# EAGLE design GDEnvSensorGW_1_16 (EAGLE 9.4.0)
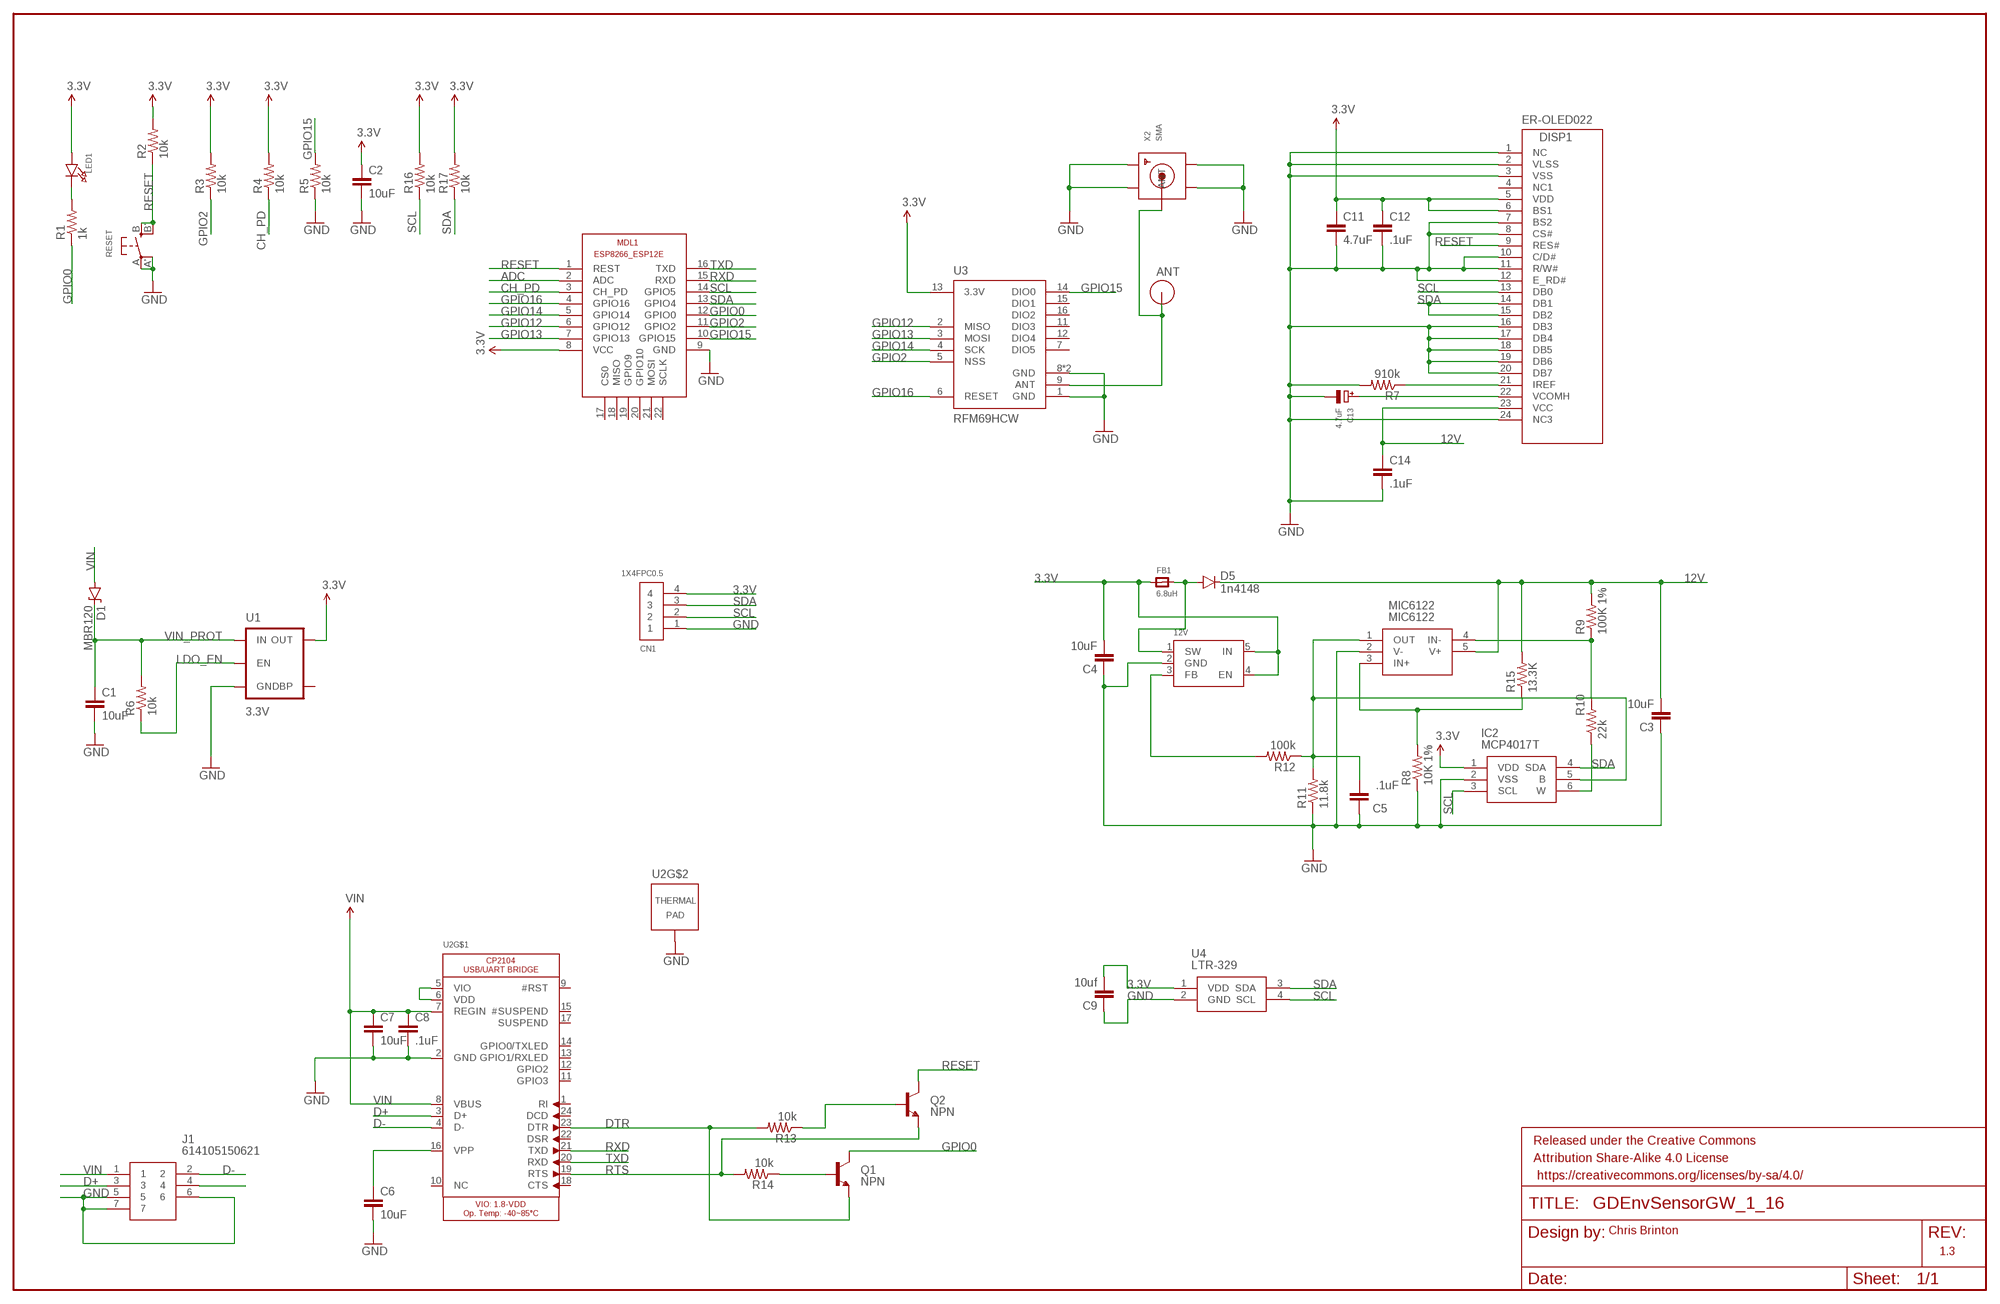
[diagram p0: schematic, sheet 1]

## Parts
12V  MP1541_SOT23-5  [SOT23-5]
ANT  RFM12B_ANTENNA  [RFM12B-ANTENNA]
C1  10uF  10UF10V10%(0805)  [0805-CAP]
C2  10uF  10UF10V10%(0805)  [0805-CAP]
C3  10uF  10UF10V10%(0805)  [0805-CAP]
C4  10uF  10UF10V10%(0805)  [0805-CAP]
C5  .1uF  10UF10V10%(0805)  [0805-CAP]
C6  10uF  10UF10V10%(0805)  [0805-CAP]
C7  10uF  10UF10V10%(0805)  [0805-CAP]
C8  .1uF  10UF10V10%(0805)  [0805-CAP]
C9  10uf  10UF10V10%(0805)  [0805-CAP]
C11  4.7uF  10UF10V10%(0805)  [0805-CAP]
C12  .1uF  10UF10V10%(0805)  [0805-CAP]
C13  4.7uF  CAP_TANTALUMA/3216_REFLOW  [EIA3216-18/A-R]
C14  .1uF  10UF10V10%(0805)  [0805-CAP]
CN1  1X4FPC0.5  [FPC_0.5MM-4]
D1  MBR120  DIODE-ZENER16V  [SOD-123]
D5  1n4148  DIODEBAS16  [SOD-323]
DISP1  ER-OLED022  [ER-OLED022]
FB1  6.8uH  FERRITE_0805  [_0805]
FRAME1  FRAME-LEDGER  [CREATIVE_COMMONS]
IC2  MCP4017T  MCP4017T-503E_LT  [SOT65P210X110-6N]
J1  614105150621  [614105150621]
LED1  LED0805  [CHIPLED_0805]
MDL1  ESP8266-ESP12F  ESP8266-12EESP8266-ESP12E  [ESP8266-ESP12E]
MIC6122  MIC6122  MIC6211YM5-TR  [SOT95P280X145-5N]
Q1  NPN  TRANSISTOR_NPNMMBT2222A  [SOT23-3]
Q2  NPN  TRANSISTOR_NPNMMBT2222A  [SOT23-3]
R1  1k  R-US_R0805  [R0805]
R2  10k  R-US_R0805  [R0805]
R3  10k  R-US_R0805  [R0805]
R4  10k  R-US_R0805  [R0805]
R5  10k  R-US_R0805  [R0805]
R6  10k  R-US_R0805  [R0805]
R7  910k  R-US_R0805  [R0805]
R8  10K 1%  R-US_R0805  [R0805]
R9  100K 1%  R-US_R0805  [R0805]
R10  22k  R-US_R0805  [R0805]
R11  11.8k  R-US_R0805  [R0805]
R12  100k  R-US_R0805  [R0805]
R13  10k  R-US_R0805  [R0805]
R14  10k  R-US_R0805  [R0805]
R15  13.3K  R-US_R0805  [R0805]
R16  10k  R-US_R0805  [R0805]
R17  10k  R-US_R0805  [R0805]
RESET  SWITCH_TACT_SMT4.6X2.8  [BTN_KMR2_4.6X2.8]
U1  3.3V  V_REG_MIC52193.3V  [SOT23-5]
U2  CP2104  [QFN24_4MM_SMSC]
U3  RFM69HCW  [RFM69HCW-XXXS2]
U4  LTR-329  LTR-329ALS-01  [LTR329ALS01]
X2  SMA  SMACONNECTOR_EDGE_UFL  [SMA_EDGELAUNCH_UFL]

## Nets
3.3V: 12V.4(EN) 12V.5(IN) C2.1 C4.2 C9.2 C11.1 C12.1 CN1.4 DISP1.5(VDD) DISP1.6(BS1) FB1.1 IC2.1(VDD) LED1.A MDL1.8(VCC) R2.2 R3.2 R4.2 R16.2 R17.2 U1.5(OUT) U3.13(3.3V) U4.1(VDD)
12V: C3.2 C14.1 D5.C DISP1.23(VCC) MIC6122.5(V+) R9.2 R15.2
ADC: MDL1.2(ADC)
ANT: ANT.P$1 U3.9(ANT) X2.P(ANT)
CH_PD: MDL1.3(CH_PD) R4.1
D+: J1.3 U2.3(D+)
D-: J1.2 U2.4(D-)
DTR: Q1.2(E) R13.2 U2.23(DTR)
GND: 12V.2(GND) C1.2 C2.2 C3.1 C4.1 C5.1 C6.2 C7.2 C8.2 C9.1 C11.2 C12.2 C13.- C14.2 CN1.1 DISP1.1(NC) DISP1.2(VLSS) DISP1.3(VSS) DISP1.7(BS2) DISP1.8(CS#) DISP1.10(C/D#) DISP1.11(R/W#) DISP1.12(E_RD#) DISP1.16(DB3) DISP1.17(DB4) DISP1.18(DB5) DISP1.19(DB6) DISP1.20(DB7) DISP1.24(NC3) IC2.2(VSS) J1.5 J1.6 J1.7 MDL1.9(GND) MIC6122.2(V-) R5.1 R7.2 R8.1 R11.1 RESET.A'(P1) RESET.A(P) U1.2(GND) U2.2(GND) U2.THERM(TP) U3.1(GND) U3.8(GND) U3.10(GND) U4.2(GND) X2.GND@1(GND1) X2.GND@2(GND2) X2.GND@3(GND3) X2.GND@4(GND4)
GPIO0: MDL1.12(GPIO0) Q1.3(C) R1.1
GPIO2: MDL1.11(GPIO2) R3.1 U3.5(NSS)
GPIO12: MDL1.6(GPIO12) U3.2(MISO)
GPIO13: MDL1.7(GPIO13) U3.3(MOSI)
GPIO14: MDL1.5(GPIO14) U3.4(SCK)
GPIO15: MDL1.10(GPIO15) R5.2 U3.14(DIO0)
GPIO16: MDL1.4(GPIO16) U3.6(RESET)
LDO_EN: R6.1 U1.3(EN)
N$1: U2.5(VIO) U2.6(VDD)
N$2: MIC6122.3(IN+) R8.2 R15.1
N$3: LED1.C R1.2
N$4: C13.+ DISP1.22(VCOMH)
N$5: C6.1 U2.16(VPP)
N$6: C5.2 IC2.5(B) MIC6122.1(OUT) R11.2 R12.1
N$7: MIC6122.4(IN-) R9.1 R10.2
N$8: 12V.1(SW) D5.A FB1.2
N$9: Q2.1(B) R13.1
N$11: DISP1.21(IREF) R7.1
N$12: IC2.6(W) R10.1
N$15: 12V.3(FB) R12.2
N$16: J1.4
N$17: Q1.1(B) R14.1
RESET: DISP1.9(RES#) MDL1.1(REST) Q2.3(C) R2.1 RESET.B'(S1) RESET.B(S)
RTS: Q2.2(E) R14.2 U2.19(RTS)
RXD: MDL1.15(RXD) U2.21(TXD)
SCL: CN1.2 DISP1.13(DB0) IC2.3(SCL) MDL1.14(GPIO5) R16.1 U4.4(SCL)
SDA: CN1.3 DISP1.14(DB1) DISP1.15(DB2) IC2.4(SDA) MDL1.13(GPIO4) R17.1 U4.3(SDA)
TXD: MDL1.16(TXD) U2.20(RXD)
VIN: C7.1 C8.1 D1.A J1.1 U2.7(REGIN) U2.8(VBUS)
VIN_PROT: C1.1 D1.C R6.2 U1.1(IN)
Unconnected: DISP1.4(NC1) MDL1.17(CS0) MDL1.18(MISO) MDL1.19(GPIO9) MDL1.20(GPIO10) MDL1.21(MOSI) MDL1.22(SCLK) U1.4(BP) U2.1(RI) U2.9(#RST) U2.10(NC) U2.11(GPIO3) U2.12(GPIO2) U2.13(GPIO1/RXLED) U2.14(GPIO0/TXLED) U2.15(#SUSPEND) U2.17(SUSPEND) U2.18(CTS) U2.22(DSR) U2.24(DCD) U3.7(DIO5) U3.11(DIO3) U3.12(DIO4) U3.15(DIO1) U3.16(DIO2)

## Notes on the sheet
- Chris Brinton
- 1.3

## Library data of the parts
12V = GDTech:MP1541_SOT23-5: SOT23-5 MP1541 Voltage Boost The MP1541 is a 5-pin thin SOT23 current mode step up converter intended for small, low power applications
ANT = LowPowerLab:RFM12B_ANTENNA; LABEL: ANT
C1-C9 C11 C12 C14 = SparkFun-Capacitors:10UF10V10%(0805): CAP-11330; PROD_ID: CAP-11330
C13 = microbuilder:CAP_TANTALUM: Tantalum Capacitors Wave footprints have larger pads and are meant to be used for hand soldering. Reflow footprints are optimised for solder paste and a reflow oven. EIA3216-18/A-[R/W] - Size A / 3216-18 / 1206 footprint 4.7µF 25V 10% Tantalum Capacitor 10µF 16V 10% Tantalum Capacitor [Digikey: 495-2236-2-ND] EIA3528-21/B-[R/W] - Size B / 3528-21 47µF 10V 10% Tantalum Capactior [Digikey: 495-2216-1-ND] EIA6032-28/C-[R/W] - Size C / 6032-28 10µF 35V 20% Tantalum Capacitor [Digikey: 495-2285-1-ND] 100µF 16V 10% Tantalum Capactior [Digikey: 399-5214-1-ND]
CN1 = adafruit:1X4: 4-pin connector
D1 = SparkFun-DiscreteSemi:DIODE-ZENER: Zener Diode Production Part - 8199 3.4V Zener Voltage; PROD_ID: DIO-12440; VALUE: 16V
D5 = SparkFun-DiscreteSemi:DIODE: Diode These are standard reverse protection diodes and small signal diodes. SMA package can handle up to about 1A. SOD-323 can handle about 200mA. What the SOD-323 package when ordering, there are some mfgs out there that are 5-pin packages.; PROD_ID: DIO-09646; VALUE: 250mA/100V
DISP1 = GDTech:ER-OLED022: East Rising 2.2" OLED display 128x32 24 pin .5mm pitch FPC connector
FB1 = microbuilder:FERRITE: Ferrite Bead 0603 MMZ1608B121C - 120 Ohm @ 100MHz, 600mA, 0.15 Ohm DC Resistance - Digikey: 445-2164-1-ND BK1608HW121-T - 120 Ohm, 600mA Ferrite Chip - Digikey: 587-1876-2-ND 0805 HZ0805B272R-10 - 2.7K Ohm @ 100MHz, 200mA, 0.8 Ohm DC Resistance - Digikey: 240-2504-1-ND (see also Murata BLM21BD272SN1L) MMZ2012Y152B - 1.5K Ohm @ 100MHz, 500mA, 0.4 Ohm DC Resistance - Digikey: 445-1560-1-ND - Mainly for high frequency (80-400MHz) MMZ2012R102A - 1K Ohm @ 100MHz, 500mA, 0.3 Ohm DC Resistance - Digikey: 445-1555-2-ND - More general purpose (10-200MHz)
FRAME1 = SparkFun-Aesthetics:FRAME-LEDGER: Schematic Frame Standard 11x14 US Ledger frame
IC2 = SamacSys_Parts:MCP4017T-503E_LT: Digital POT Source: Datasheet <http://componentsearchengine.com/Datasheets/3/MCP4017T-503E_LT.pdf>; ALLIED_NUMBER: 70388684; ALLIED_PRICE-STOCK: https://www.alliedelec.com/microchip-technology-inc-mcp4017t-503e-lt/70388684/; DESCRIPTION: Digital POT; HEIGHT: mm; MANUFACTURER_NAME: Microchip; MANUFACTURER_PART_NUMBER: MCP4017T-503E/LT; MOUSER_PART_NUMBER: 579-MCP4017T503E/LT; MOUSER_PRICE-STOCK: https://www.mouser.com/Search/Refine.aspx?Keyword=579-MCP4017T503E%2FLT; RS_PART_NUMBER: 7386796P; RS_PRICE-STOCK: http://uk.rs-online.com/web/p/products/7386796P
J1 = SamacSys_Parts:614105150621: WURTH ELEKTRONIK - 614105150621 - MICRO USB, 2.0 TYPE AB, PLUG, CABLE Source: Datasheet <http://katalog.we-online.de/em/datasheet/614105150621.pdf>; DESCRIPTION: WURTH ELEKTRONIK - 614105150621 - MICRO USB, 2.0 TYPE AB, PLUG, CABLE; HEIGHT: 5mm; MANUFACTURER_NAME: Wurth Elektronik; MANUFACTURER_PART_NUMBER: 614105150621; MOUSER_PART_NUMBER: 710-614105150621; MOUSER_PRICE-STOCK: https://www.mouser.com/Search/Refine.aspx?Keyword=710-614105150621; RS_PART_NUMBER: 1225098; RS_PRICE-STOCK: http://uk.rs-online.com/web/p/products/1225098
LED1 = microbuilder:LED: LED 0603 - 0603 Surface Mount Package 2mA: Green LED - Low Power (3.9mcd, 2ma, 1.7Vf) - Digikey: 475-2709-2-ND Orange LED - Low Power (9.8mcd, 2ma, 1.8Vf) - Digikey: 475-1194-2-ND Red LED - Low Power (5mcd, 2ma, 1.8Vf) - Digikey: 475-1195-2-ND Yellow LED - Low Power (7mcd, 2ma, 1.8Vf) - Digikey: 475-1196-2-ND 5mA: Blue LED - Low Power (17mcd, 5ma, 2.9Vf) - Digikey: LNJ937W8CRACT-ND 0805 - 0805 Surface Mount Package 2mA: Red LED (8.8mcd, 2mA, 1.8Vf, Clear) - Low Power [Digikey: 475-2510-1-ND] Green LED (5mcd, 2mA, 1.8Vf, Clear) - Low Power [Digikey: 475-2730-1-ND] Yellow LED (11.3mcd, 2mA, 1.8Vf, Clear) - Low Power [Digikey: 475-2555-1-ND] 20mA: Red LED (104mcd, 20mA, Diffused) - LS R976 [Digikey: 475-1278-6-ND] Red LED (12mcd, 20mA, 2.0Vf, Clear) - APT2012EC [Digikey: 754-1128-1-ND] Green LED (15mcd, 20mA, 2.2Vf, Clear) - APT2012GC [Digikey: 754-1131-1-ND] Orange LED (160mcd, 20mA, 2.1Vf, Clear) - APT2012SECK [Digikey: 754-1130-1-ND] 1206 - 1206 Surface Mount Package Green LED (26mcd, 20mA, Diffused) - LG N971 [Digikey: 475-1407-6-ND] Red LED (15mcd, 20mA, Diffused) - LH N974 [Digikey: 475-1416-6-ND]
MDL1 = ESP12E:ESP8266-12E: ESP8266-12E with additional I/O and GPIO04/05 corrected The author cannot warrant that this library is free from error or will meet your specific requirements. Created by PuceBaboon.com. Komagane, Nagano, JAPAN
MIC6122 = SamacSys_Parts:MIC6211YM5-TR: Operational Amplifiers - Op Amps Source: Datasheet <http://ww1.microchip.com/downloads/en/DeviceDoc/mic6211.pdf>; DESCRIPTION: Operational Amplifiers - Op Amps; HEIGHT: 1.45mm; MANUFACTURER_NAME: Micrel; MANUFACTURER_PART_NUMBER: MIC6211YM5-TR; MOUSER_PART_NUMBER: 998-MIC6211YM5TR; MOUSER_PRICE-STOCK: https://www.mouser.com/Search/Refine.aspx?Keyword=998-MIC6211YM5TR
Q1 Q2 = SparkFun-DiscreteSemi:TRANSISTOR_NPN: Generic NPN BJT MMBT2222A - TRANS-08049 (SOT-23, 1A 40V) MPSA42 - TRANS-09116 (SOT-23, 500mA 300V) MMBT5088LT1G - TRANS-11160 (SOT-23, 50 mA 30V) BC547 - COM-08928 <http://www.sparkfun.com/products/8928> (TO-92 45V 100mA) (1.Collector 2.Base 3.Emitter) 2N3904 - COM-00521 <http://www.sparkfun.com/products/521> (TO-92 40V 200mA) (1.Emitter 2.Base 3.Collector) P2N2222A - COM-12852 <http://www.sparkfun.com/products/12852> (TO-92 40V 600mA) (1.Collector 2.Base 3.Emitter); PROD_ID: TRANS-08049; VALUE: MMBT2222A
R1-R17 = adafruit:R-US_: RESISTOR, American symbol
RESET = microbuilder:SWITCH_TACT_SMT: SMT Tact Switches 6x6mm - Digikey: P12940SCT-ND KMR2 (4.6x2.8mm) - Digikey: 401-1426-1-ND EVQ-PQHB55 - Light Touch, 160GF (4.5x4.5mm) - Digikey: P8090SCT-ND
U1 = SparkFun-PowerIC:V_REG_MIC5219: V_REG MIC5219 Standard 3.3V and 5V 500mA LDO voltage regulator in SOT-23 layout. Micrel part MIC5219. BP (by-pass) pin is used to lower output noise with 470pF cap, may be left open.; PROD_ID: VREG-09872; VALUE: MIC5219 3.3V
U2 = GDTech:CP2104: CP2104 - USB to UART Bridge VDD Output: 3.45V
U3 = SparkFun-RF:RFM69H; PROD_ID: IC-11997, IC-12053
U4 = SamacSys_Parts:LTR-329ALS-01: Ambient Light Sensors Ambient Light Photo Sensor Source: Datasheet <http://www.mouser.com/ds/2/239/liteon_LTR-329ALS-01-1175539.pdf>; DESCRIPTION: Ambient Light Sensors Ambient Light Photo Sensor; HEIGHT: 0mm; MANUFACTURER_NAME: Lite-On; MANUFACTURER_PART_NUMBER: LTR-329ALS-01; MOUSER_PART_NUMBER: 859-LTR-329ALS-01; MOUSER_PRICE-STOCK: https://www.mouser.com/Search/Refine.aspx?Keyword=859-LTR-329ALS-01
X2 = adafruit:SMACONNECTOR: SMA Connector 90° DIP SMA Connector, 50 Ohm (4UConnector: 07259)

## Board
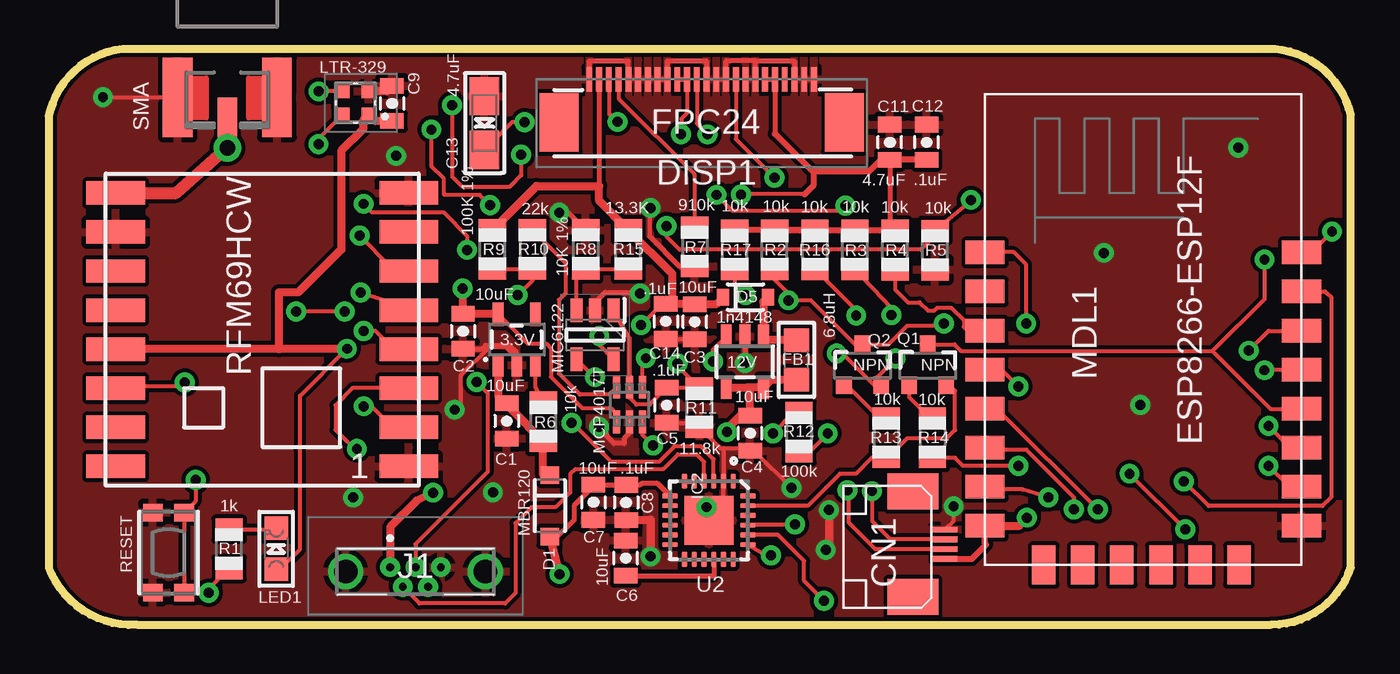
[diagram p1: board, top side]
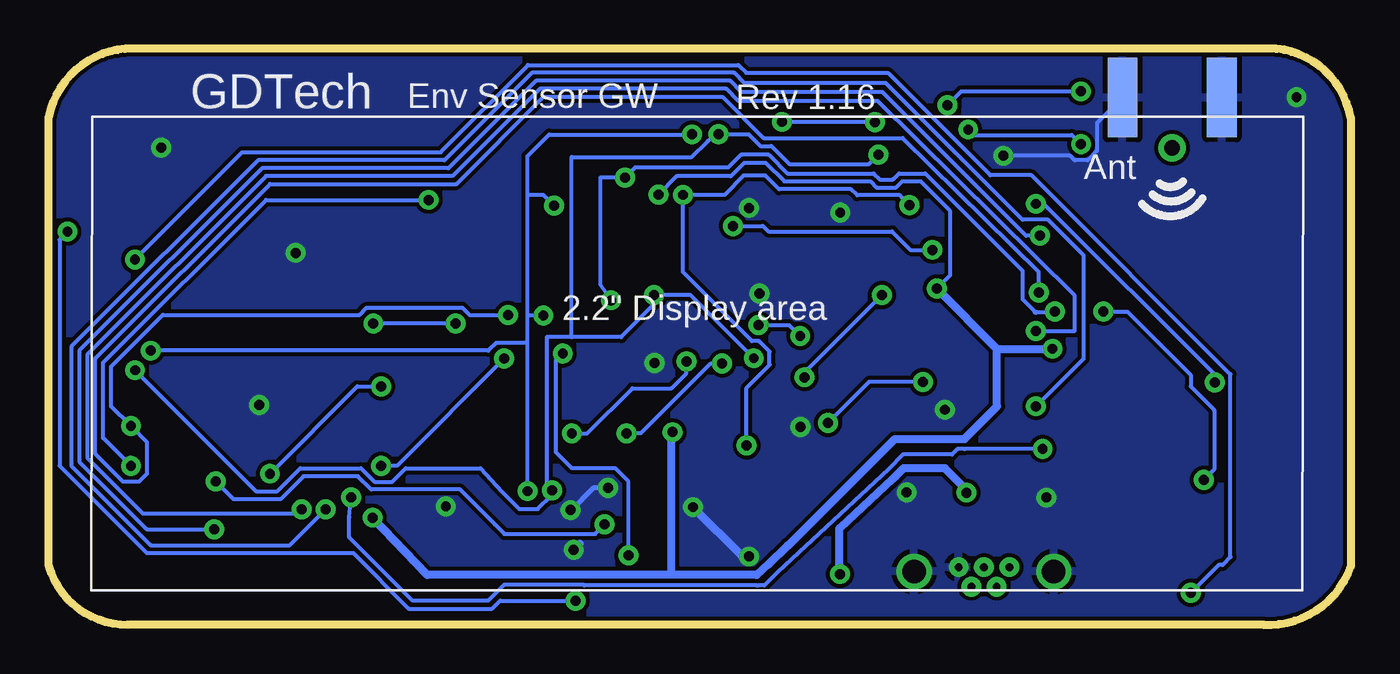
[diagram p2: board, bottom side, seen from below]

Size 66.64 x 29.5 mm. Coordinates in mm from the lower left corner, seen from the top.
Outline: 0,25.99 arc-74 3.8,29.5 62.74,29.5 arc-74 66.64,26.04 66.64,3 arc-74 62.59,0.01 4.49,0.01 arc-74 0,2.97 0,25.99
Copper layers (1*16): Top 0.035mm / dielectric 1.5mm / Bottom 0.035mm
Design rules "SparkFun": minimum track width 8mil, minimum drill 20mil, track to track 8mil, track to pad 8mil, pad to pad 8mil, via to via 8mil, smd to smd 8mil, copper to edge 8mil, drill to drill 8mil, minimum pad ring 12mil, minimum via ring 10mil, stop-mask expansion 4mil, vias tented up to drill 20mil, thermal gap 10mil

### Footprints (pad centres in the part's own frame; a part is rotated, then mirrored left to right if it is on the bottom)
SOT23-5 = smd 0.55 x 1.2: 1 -0.95,-1.3; 2 0,-1.3; 3 0.95,-1.3; 4 0.95,1.3; 5 -0.95,1.3
RFM12B-ANTENNA = drill 0.8 pad 1.422: P$1 0,0
0805-CAP = smd 0.8 x 1.2: 1 -0.9,0; 2 0.9,0
EIA3216-18/A-R = smd 1.95 x 1.5: + 1.375,0; - -1.375,0
FPC_0.5MM-4 = smd 0.3 x 1.25: 1 -0.75,-0.45; 2 -0.25,-0.45; 3 0.25,-0.45; 4 0.75,-0.45 | smd 1.85 x 2.6: MT -2.7,-2.1; MT2 2.7,-2.1
SOD-123 = smd 0.9 x 0.95: A 1.575,0; C -1.575,0
SOD-323 = smd 0.63 x 0.83: A 1.15,0; C -1.15,0
ER-OLED022 = smd 0.3 x 1.25: 1 5.75,12.905; 2 5.25,12.905; 3 4.75,12.905; 4 4.25,12.905; 5 3.75,12.905; 6 3.25,12.905; 7 2.75,12.905; 8 2.25,12.905; 9 1.75,12.905; 10 1.25,12.905; 11 0.75,12.905; 12 0.25,12.905; 13 -0.25,12.905; 14 -0.75,12.905; 15 -1.25,12.905; 16 -1.75,12.905; 17 -2.25,12.905; 18 -2.75,12.905; 19 -3.25,12.905; 20 -3.75,12.905; 21 -4.25,12.905; 22 -4.75,12.905; 23 -5.25,12.905; 24 -5.75,12.905 | smd 2 x 3: MOUNT1 -7.3,10.705; MOUNT2 7.3,10.705
_0805 = smd 1.2 x 1.3: 1 -1.016,0; 2 1.016,0
SOT65P210X110-6N = smd 1.168 x 0.356: 1 -0.889,0.66; 2 -0.889,0; 3 -0.889,-0.66; 4 0.889,-0.66; 5 0.889,0; 6 0.889,0.66
614105150621 = drill 0.4 pad 0.9: 1 -1.3,-0.065; 2 -0.65,-1.065; 3 0,-0.065; 4 0.65,-1.065; 5 1.3,-0.065 | drill 1.2 pad 1.8: 6 -3.575,-0.285; 7 3.575,-0.285
CHIPLED_0805 = smd 1.2 x 1.2: A 0,-1.05; C 0,1.05
ESP8266-ESP12E = smd 2 x 1.2: 1 0,16; 2 0,14; 3 0,12; 4 0,10; 5 0,8; 6 0,6; 7 0,4; 8 0,2; 9 16.2,2; 10 16.2,4; 11 16.2,6; 12 16.2,8; 13 16.2,10; 14 16.2,12; 15 16.2,14; 16 16.2,16 | smd 1.2 x 2: 17 11,0; 18 3,0; 19 5,0; 20 13,0; 21 7,0; 22 9,0
SOT95P280X145-5N = smd 1.2 x 0.6: 1 -1.25,0.95; 2 -1.25,0; 3 -1.25,-0.95; 4 1.25,-0.95; 5 1.25,0.95
SOT23-3 = smd 0.8 x 0.9: 1 -0.95,-1; 2 0.95,-1; 3 0,1.1
R0805 = smd 1.1 x 1.4: 1 -1,0; 2 1,0
BTN_KMR2_4.6X2.8 = smd 0.9 x 1: A 2.05,0.8; A' -2.05,0.8; B 2.05,-0.8; B' -2.05,-0.8
QFN24_4MM_SMSC = smd 0.8 x 0.28: 1 -2,1.25; 2 -2,0.75; 3 -2,0.25; 4 -2,-0.25; 5 -2,-0.75; 6 -2,-1.25; 13 2,-1.25; 14 2,-0.75; 15 2,-0.25; 16 2,0.25; 17 2,0.75; 18 2,1.25 | smd 0.28 x 0.8: 7 -1.25,-2; 8 -0.75,-2; 9 -0.25,-2; 10 0.25,-2; 11 0.75,-2; 12 1.25,-2; 19 1.25,2; 20 0.75,2; 21 0.25,2; 22 -0.25,2; 23 -0.75,2; 24 -1.25,2 | smd 2.5 x 2.5: THERM 0,0
RFM69HCW-XXXS2 = smd 3 x 1.2: 1 -7.5,7; 2 -7.5,5; 3 -7.5,3; 4 -7.5,1; 5 -7.5,-1; 6 -7.5,-3; 7 -7.5,-5; 8 -7.5,-7; 9 7.5,-7; 10 7.5,-5; 11 7.5,-3; 12 7.5,-1; 13 7.5,1; 14 7.5,3; 15 7.5,5; 16 7.5,7
LTR329ALS01 = smd 0.7 x 0.75: 1 -0.6,-0.4; 2 0.6,-0.4; 3 0.6,0.95; 4 -0.6,0.95
SMA_EDGELAUNCH_UFL = smd 4.064 x 1.524: GND@1 2.032,-2.54; GND@2 2.032,2.54 | smd 4.064 x 1.524 bottom: GND@3 2.032,2.54; GND@4 2.032,-2.54 | smd 2.032 x 1.016: P 3.048,0

### Placement (x,y rotation side)
12V  35.63,13.47 180 top
ANT  9.14,24.43 0 top
C1  23.44,10.44 270 top
C2  21.2,15.03 270 top
C3  33.07,15.52 90 top
C4  35.9,9.82 90 top
C5  31.63,11.25 90 top
C6  29.53,3.42 90 top
C7  27.88,6.28 270 top
C8  29.55,6.27 270 top
C9  17.57,26.7 270 top
C11  43.05,24.71 90 top
C12  44.93,24.72 90 top
C13  22.3,25.7 270 top
C14  31.58,15.54 270 top
CN1  46.33,4.13 270 top
D1  25.64,6.1 270 top
D5  35.66,16.78 0 top
DISP1  33.42,15.03 0 top
FB1  38.27,13.57 90 top
FRAME1  1.73,-12.1 0 top  (outside the outline)
IC2  29.72,11.28 90 top
J1  18.77,3.02 0 top
LED1  11.64,3.9 0 top
MDL1  47.92,3.07 0 top
MIC6122  27.96,14.85 270 top
Q1  44.99,13.27 0 top
Q2  41.65,13.27 0 top
R1  9.23,3.89 90 top
R2  37.15,19.21 90 top
R3  41.26,19.2 90 top
R4  43.32,19.19 90 top
R5  45.36,19.18 90 top
R6  25.31,10.39 270 top
R7  33.06,19.35 270 top
R8  27.48,19.23 270 top
R9  22.71,19.23 90 top
R10  24.75,19.23 270 top
R11  33.3,11.12 90 top
R12  38.4,9.87 270 top
R13  42.86,9.58 270 top
R14  45.23,9.58 270 top
R15  29.66,19.23 90 top
R16  39.22,19.21 90 top
R17  35.11,19.21 90 top
RESET  6.13,3.7 90 top
U1  23.95,14.61 0 top
U2  33.79,5.36 270 top
U3  10.92,15.12 180 top
U4  15.98,26.73 90 top
X2  9.14,29.04 270 top

### Tracks (layer width: path | path; a pad name or v marks a point on that pad's centre or on a via)
3.3V  (via drill 0.51, 0.51 pad 1.02)
  Top 0.203: R3.2 41.28,20.22 43.32,20.22 | LED1.A 11.84,2.86 12.86,3.88 12.86,11.73 15.24,14.12 | 38.69,22.05 35.46,22.05 v35.44,22.03 | U1.5 24.51,14.4 25.47,14.4 25.7,14.16 25.7,12.7 27.3,11.1 28.77,11.1 29.06,10.81 IC2.1 | R4.2 43.31,20.18 43.21,20.18 | 35.77,12.17 35.9,12.17
  Top 0.254: 37.17,25.15 DISP1.5 DISP1.6 | C11.1 43.05,20.46 R4.2
  Top 0.305: 39.13,23.19 39.13,22.48 38.69,22.05 | 37.17,25.15 39.13,23.19 | R2.2 37.18,20.18 43.21,20.18 | R4.2 43.32,20.22 | C12.1 44.98,23.81 C11.1 42.58,23.81 41.97,23.2 39.14,23.2 39.13,23.19 | CN1.4 47.24,3.38 47.97,4.11 47.92,4.15 MDL1.8 | R16.2 R2.2 | R2.2 R17.2
  Top 0.406: U1.5 21.23,15.91 C2.1 21.18,15.95 v21.18,17.22 | 11.77,14.12 15.24,14.12 v15.26,14.14 | 11.77,14.12 U3.13 | MDL1.8 49.68,5.07 v50.07,5.49 | 12V.4 35.77,12.17 | FB1.1 36.96,12.55 12V.5 35.9,12.17 C4.2 35.4,10.72 34.72,10.04 v34.72,9.87 | 11.77,14.12 11.77,17.02 12.77,17.02 14.96,19.21 14.96,24.27 16.09,25.4 16.09,25.84 U4.1 16.71,25.8 C9.2
  Bottom 0.203: v21.18,17.22 20.49,17.91 20.49,21.19 22.01,22.71 22.95,22.71 23.27,22.4 24.27,22.4 24.59,22.71 28.99,22.71 29.95,23.66 31.03,23.66 31.72,22.97 34.5,22.97 v35.44,22.03
  Bottom 0.406: 18.1,14.14 v15.26,14.14 | 18.1,14.14 v21.18,17.22 | v50.07,5.49 47.27,2.56 35.77,2.56 34.77,2.56 | 34.77,2.56 30.48,2.57 30.41,2.55 29.77,3.12 28.84,4.05 28.8,4.05 23.34,9.52 19.77,9.52 18.1,11.19 18.1,14.14 | 34.77,2.56 34.77,9.82 v34.72,9.87
12V  (via drill 0.51)
  Top 0.203: MIC6122.5 28.18,14.33 v28.18,14.79 | v30.31,15.35 31.4,16.44 C14.1
  Top 0.254: DISP1.23 28.17,22.47
  Top 0.406: D5.C 34.14,16.41 C3.2 31.6,16.42 C14.1 31.9,16.75 31.9,17.99 R15.2 28.17,21.72 28.17,22.47 24.96,22.47 R9.2
  Bottom 0.203: v28.18,14.79 28.73,15.34 v30.31,15.34 v30.31,15.35
ANT
  Top 0.61: U3.9 6.52,22.12 ANT.P$1 9.16,24.92 X2.P
CH_PD
  Top 0.203: R4.1 43.32,17.18 43.98,16.52 44.57,16.52 45,16.09 45.33,16.09 45.48,16.24 46.19,16.24 46.83,15.6 46.83,15.26 47,15.09 47.91,15.09 MDL1.3
D+  (via drill 0.51)
  Top 0.203: U2.3 34.03,8.48 33.37,9.14 32.03,9.14 31.26,8.38 28.77,8.38 26.81,10.34 v26.75,10.34 | v21.9,12.44 22.46,11.88 22.46,7.83 18.77,4.14 J1.3
  Bottom 0.203: v21.9,12.44 24.65,12.44 v26.75,10.34
D-
  Top 0.203: U2.4 33.54,8.34 33.14,8.73 32.19,8.73 31.43,7.97 26.94,7.97 26.69,7.72 26.69,6.78 25.93,6.02 24.7,6.02 23.89,5.21 23.89,1.63 23.36,1.1 18.97,1.1 J1.2
DTR
  Top 0.203: Q1.2 46.1,12.27 46.38,11.98 46.38,9.97 45.98,9.57 43.94,9.57 42.93,8.55 R13.2 42.72,8.55 42.12,8.55 41.3,7.74 40.49,7.74 39.77,7.02 38.85,6.1 U2.23
GND  (via drill 0.51, 0.51 pad 1.02)
  Top 0.203: DISP1.11 DISP1.10 | DISP1.2 DISP1.1 | X2.GND@1 2.78,27.01 v2.77,27.02 | CN1.1 46.32,5.32 v46.32,6.07 | C5.1 33.07,10.35 R11.1 34.39,9.02 34.54,9.02 | 34.54,9.02 U2.2 | 34.54,9.02 35.79,9.02 C4.1 36.1,8.92 v38.01,7.01 | C14.2 33.05,14.64 | 33.05,14.64 33.18,14.64 | 33.05,14.64 C3.1 33.22,14.62 | U2.THERM 34.54,6.11 34.54,7.02 | 30.77,19.87 30.77,21.33 v30.79,21.35 | C9.1 17.3,27.33 | v20.77,11.02 21.09,11.33 21.09,12.77 22.52,14.21 23.4,14.21 23.65,13.97 23.94,13.97
  Top 0.254: DISP1.16 31.68,27.93 31.69,27.93 DISP1.16 | U2.2 34.54,7.02 | 33.79,5.88 U2.THERM | C2.2 22.16,14.13 22.35,14.32 23.59,14.32 23.94,13.97 U1.2 | DISP1.24 27.67,28.84 27.66,28.85 27.66,28.88 27.67,28.89 29.66,28.89 DISP1.20 | DISP1.12 33.66,28.89 31.9,28.89 31.92,28.89 31.67,28.89 31.67,28.88 DISP1.16 | DISP1.10 34.67,28.86 34.67,28.9 34.86,28.89 34.88,28.89 36.16,28.89 | DISP1.7 36.17,28.88 36.16,28.89 | 36.16,28.89 38.15,28.89 38.16,28.88 DISP1.3 | DISP1.17 DISP1.16 | IC2.2 29.72,9.81 29.45,9.54 29.45,9.29 28.93,9.29 28.55,9.67 28.55,9.75 v28.17,10.13 | MIC6122.2 27.96,16.51 28.47,17.03 30.21,17.03 v30.27,16.97 | 12V.2 v35.63,13.41 | R7.2 32.29,18.35 30.77,19.87 | R8.1 26.6,21.1 v26.13,21.1
  Top 0.406: C8.2 30.78,5.37 30.8,5.39 v30.8,3.5 | v39.77,3.84 39.94,4.01 v39.94,5.88 | 17.3,27.33 U4.2
  Bottom 0.203: X2.GND@2 12.99,25.7 12.99,24.27 13.46,23.79 14.14,23.79 14.36,24.02 v17.77,24.02
  Bottom 0.254: v38.01,7.01 38.78,7.01 39.94,5.85 v39.94,5.88
  Bottom 0.406: v30.8,3.5 31.14,3.5 v33.67,6.03 | v39.77,3.84 39.47,4.15
  other vias: 54,19.05 60.89,24.44 55.88,11.27 22.73,6.79 15.58,6.52
  pour Top: 4.05,30.43 62.6,29.59 arc-90 66.67,25.52 67.67,3.43 arc-90 63.18,-0.08 3.86,-0.02 arc-90 -0.05,3.04 -0.08,26.19 arc-90
  pour Bottom: 4.27,29.32 63.04,30.03 arc-90 67.77,24.82 66.77,3.52 arc-90 63.27,0.02 4.17,-1.38 arc-90 0.06,2.64 0.07,25.22 arc-90
GPIO0  (via drill 0.51)
  Top 0.203: Q1.3 46.36,14.37 46.7,14.03 59.56,14.03 | 59.56,14.03 62.53,11.06 64.11,11.06 MDL1.12 | v8.18,1.64 8.18,1.85 9.2,2.86 R1.1 | v62.23,18.71 62.23,16.68 59.59,14.04 59.56,14.03
  Bottom 0.203: v8.18,1.64 6.76,3.07 6.56,3.07 6.15,3.47 6.15,12.83 16.34,23.02 18.45,23.02 23.69,28.26 30.94,28.26 31.35,28.67 42.12,28.67 46.59,24.2 56.75,24.2 v62.23,18.71
GPIO2  (via drill 0.51)
  Top 0.203: v62.44,10.18 63.45,9.16 64.06,9.16 MDL1.11 | v43.13,15.87 43.13,16.22 R3.1 | v15.97,17.02 18.34,16.27 U3.5
  Bottom 0.203: v15.97,17.02 15.97,18.07 22.94,24.93 30.05,24.93 32.16,27.04 41.3,27.04 45.77,22.57 55.32,22.57 64.26,13.63 64.26,8.76 62.84,7.33 62.03,7.33 61.62,7.74 61.62,9.36 v62.44,10.18 63.45,11.19 63.45,13.23 60.81,15.87 50.74,15.87 50.37,16.24 45.48,16.24 45.11,15.87 v43.13,15.87
GPIO12  (via drill 0.51)
  Top 0.203: v52.48,5.91 52.48,6.52 50.04,8.96 48.01,8.96 MDL1.6 | v16.11,11.19 16.51,11.19 17.53,10.18 18.34,10.18 U3.2
  Bottom 0.203: v52.48,5.91 54.31,4.08 61.42,4.08 65.48,8.15 65.48,14.24 55.93,23.79 46.38,23.79 41.91,28.26 31.55,28.26 31.03,27.74 23.79,27.74 16.79,20.74 15.5,20.74 13.67,18.92 13.67,13.63 v16.11,11.19
GPIO13  (via drill 0.51, 0.51 pad 1.02)
  Top 0.203: v51.17,6.52 49.84,6.93 48.01,6.93 MDL1.7 | U3.3 15.55,12.12 14.67,11.24 14.67,9.99 15.66,9 15.75,9 v15.77,9.02
  Bottom 0.203: v51.17,6.52 51.26,5.5 51.26,4.49 48.01,1.24 44.15,1.24 43.33,2.05 39.27,2.05 39.24,2.02 30.4,2.02 30.35,2 30.32,2.02 30.01,2.02 29.35,2.68 23.66,7.97 22.91,8.72 20.41,8.72 20.12,9.01 19.77,9.01 18.11,9.02 v15.77,9.02
GPIO14  (via drill 0.51)
  Top 0.203: v53.7,5.91 48.62,10.99 48.01,10.99 MDL1.5 | v16.11,15.05 16.72,15.05 17.53,14.24 18.34,14.24 U3.4
  Bottom 0.203: v53.7,5.91 53.9,5.71 61.83,5.71 64.67,8.55 64.67,13.84 55.53,22.98 45.98,22.98 41.51,27.45 31.96,27.45 31.33,26.82 24.21,26.82 14.12,16.86 14.12,15.06 v16.11,15.05
GPIO15  (via drill 0.51)
  Top 0.203: v62.44,8.15 63.45,7.13 64.06,7.13 MDL1.10 | v47.2,21.76 46.94,21.51 R5.2 45.5,20.06 44.64,19.21 32.29,19.21 31.62,19.88 v31.62,20.43 | v6.96,12.41 6.76,12.21 3.51,12.21 U3.14 | v21.41,19.2 21.41,19.92 20.2,21.13 16.54,21.13 v16.11,21.56
  Bottom 0.203: v47.2,21.76 55.53,21.76 63.86,13.43 63.86,9.57 v62.44,8.15 | v6.96,12.41 6.96,12.82 15.7,21.56 v16.11,21.56 | v31.62,20.43 30.1,20.43 29.81,20.14 23.48,20.14 22.54,19.2 v21.41,19.2
GPIO16  (via drill 0.51)
  Top 0.203: v49.63,12.21 48.82,13.02 48.01,13.02 MDL1.4 | v58.17,4.89 v55.32,7.74 | v15.9,19.93 17.53,18.31 18.34,18.31 U3.6
  Bottom 0.203: v49.63,12.21 50.85,12.21 v55.32,7.74 | v58.17,4.89 61.62,4.89 65.08,8.35 65.08,14.04 55.73,23.39 46.18,23.39 41.71,27.86 31.75,27.86 31.18,27.29 23.97,27.29 16.62,19.93 v15.9,19.93
LDO_EN
  Top 0.203: U1.3 24.9,12.18 R6.1
N$1
  Top 0.254: U2.6 U2.5
N$2
  Top 0.203: MIC6122.3 27.01,17.76 R8.2 R15.1
N$3
  Top 0.203: R1.2 11.59,4.89 LED1.C
N$4  (via drill 0.51 pad 1.02)
  Top 0.203: DISP1.22 28.68,26.13 28.71,26.16 v29.11,25.76 | v24.36,25.75 23.72,25.75 C13.+
  Bottom 0.203: v29.11,25.76 v24.37,25.76 v24.36,25.75
N$5
  Top 0.254: C6.1 34.04,2.52 U2.16
N$6  (via drill 0.51)
  Top 0.203: IC2.5 29.72,11.63 30.08,11.28 30.76,11.28 C5.2 31.66,12.12 R11.2 32.17,13.24 v32.17,13.38 | v37.06,9.81 38.12,10.87 R12.1
  Top 0.254: IC2.5 29.72,14.67 MIC6122.1
  Bottom 0.203: v32.17,13.38 32.77,13.38 36.34,9.81 v37.06,9.81
N$7  (via drill 0.51)
  Top 0.203: R9.1 R10.2 24.75,17.64 v24,16.88 | v27.96,12.68 27.93,12.68 MIC6122.4
  Bottom 0.203: v24,16.88 27.96,12.92 v27.96,12.68
N$8
  Top 0.406: FB1.2 36.76,14.58 12V.1 36.58,16.55 D5.A
N$9
  Top 0.203: Q2.1 40.75,12.35 42.72,10.38 R13.1
N$11
  Top 0.203: DISP1.21 29.17,26.95 33.04,23.08 33.04,20.33 R7.1
N$12
  Top 0.203: R10.1 26.44,18.54 26.44,16.97 26.11,16.64 26.11,12.87 27.18,11.8 28.69,11.8 IC2.6
N$15  (via drill 0.51)
  Top 0.203: v39.87,9.8 38.94,8.87 R12.2 | v34,13.49 34,14.09 12V.3
  Bottom 0.203: v39.87,9.8 39.09,9.8 36.77,12.12 34.77,12.12 34,12.88 v34,13.49
N$17
  Top 0.203: Q1.1 44.04,11.67 45.22,10.49 R14.1
RESET  (via drill 0.51 pad 1.02)
  Top 0.203: RESET.B' RESET.B 7.51,6.33 v7.51,7.42 | v45.82,15.43 45.72,15.32 43.94,15.32 42.99,14.37 Q2.3 41.26,14.37 39.01,16.62 v37.87,16.62 37.87,16.98 37.15,17.69 R2.1 | v50.03,15.43 50.03,18.45 49.4,19.08 MDL1.1 | DISP1.9 35.17,24.88 v37.15,22.9 | v15.15,16.04 v12.66,16.04
  Bottom 0.203: v45.82,15.43 v50.03,15.43 | v37.87,16.62 38.42,17.44 38.42,22.9 v37.15,22.9 36.62,23.43 31.85,23.43 31.21,24.07 29.78,24.07 28.82,23.12 24.42,23.12 24.11,22.81 23.43,22.81 23.12,23.12 21.78,23.12 16.8,18.14 16.8,16.68 16.14,16.02 | 16.11,16.02 15.17,16.02 v15.15,16.04 | v12.66,16.04 11.42,16.04 8.19,12.81 8.19,12.21 6.98,11 6.98,7.95 v7.51,7.42
  Bottom 0.254: 16.14,16.02 16.11,16.02
RTS  (via drill 0.51)
  Top 0.203: v40.33,13.9 40.63,13.9 42.23,12.3 Q2.2 42.38,12.68 v43.33,13.63 | v36.97,3.56 36.72,3.56 U2.19 | v49.63,8.15 46.79,8.15 46.38,8.55 45.37,8.55 R14.2
  Bottom 0.203: v36.97,3.56 36.97,7.34 37.64,8.02 39.85,8.02 40.7,8.87 40.7,13.53 v40.33,13.9 | v49.63,8.15 48.82,8.15 v43.33,13.63
RXD  (via drill 0.51 pad 1.02)
  Top 0.203: v38.19,5.15 38.15,5.11 U2.21 | MDL1.15 65.33,17.07 65.42,16.98 65.44,16.98 65.64,16.78 65.64,6.54 65.19,6.09 59.37,6.09 v58.11,7.35
  Bottom 0.203: v58.11,7.35 57.19,6.43 54.78,6.43 53.6,7.61 50.82,7.61 50.14,6.93 45.58,6.93 43.8,5.15 43.8,5.14 43.32,4.66 38.68,4.66 v38.19,5.15
SCL  (via drill 0.51, 0.51 pad 1.02)
  Top 0.203: DISP1.13 33.17,25.67 v33.72,25.12 | v61.42,14.04 62.44,15.05 64.06,15.05 MDL1.14 | CN1.2 43.08,4.38 42.16,5.3 42.16,6.83 v42.14,6.85 | R16.1 41.33,16.1 v41.33,15.84 | IC2.3 30.38,9.73 v30.92,9.19 | v34.18,22.02 34.98,21.22 35.78,21.22 40.55,21.22 40.77,21.44 v40.77,21.46 | v22.58,21.49 22.05,22.02 20.26,22.02 20.22,22.05 20.22,22.84 19.58,23.49 v19.58,25.37 | U4.4 13.8,24.9 v13.8,24.61
  Bottom 0.203: v42.14,6.85 42.14,14.44 | 42.14,14.44 42.14,15.84 | 42.14,15.84 42.14,22.02 | 42.14,22.02 42.14,24 41.03,25.11 v33.73,25.11 v33.72,25.12 | v61.42,14.04 44.15,14.04 43.74,14.44 42.14,14.44 | v41.33,15.84 42.14,15.84 | v30.92,9.19 30.92,12.14 29.75,13.32 29.75,13.99 30.29,14.53 30.65,14.53 34.18,18.07 v34.18,22.02 32.06,22.02 31.07,23.01 29.96,23.01 29.26,22.3 25.57,22.3 25.26,21.99 23.07,21.99 22.94,21.86 22.94,21.85 v22.58,21.49 | v40.77,21.46 41.32,22.02 42.14,22.02 | v19.58,25.37 19.3,25.09 14.28,25.09 v13.8,24.61
SDA  (via drill 0.51, 0.51 pad 1.02)
  Top 0.203: MDL1.13 62.26,13.07 v62.23,13.04 | DISP1.14 32.67,26.2 32.38,25.92 32.38,25.14 v32.37,25.13 | CN1.3 42.31,3.88 40.96,5.23 40.96,6.8 v40.88,6.88 | R17.1 35.11,17.44 v35.66,16.89 | IC2.4 30.38,13.48 v30.56,13.65 | v24.18,24.07 24.18,23.02 23.58,22.42 21.19,22.42 20.65,22.96 20.65,26.6 v20.64,26.61 | v13.81,27.32 13.83,27.34 U4.3
  Top 0.254: DISP1.15 DISP1.14
  Bottom 0.203: v62.23,13.04 56.03,6.84 54.95,6.84 53.77,8.02 50.66,8.02 49.97,7.33 49.06,7.33 48.37,8.02 44.54,8.02 43.46,6.83 42.56,5.93 41.62,5.93 40.88,6.67 v40.88,6.88 41.15,7.15 41.15,14.74 39.88,14.74 | 39.88,14.74 39.88,23.96 33.73,23.96 32.91,24.78 | 32.91,24.78 32.56,25.14 v32.37,25.13 | 39.88,14.74 37.34,14.74 35.66,16.42 v35.66,16.89 33.79,16.89 v30.56,13.65 | 32.91,24.78 32.56,25.13 30.82,25.13 30.22,24.53 29.66,24.53 28.73,23.6 24.65,23.6 v24.18,24.07 | v20.64,26.61 19.93,27.32 v13.81,27.32
TXD  (via drill 0.51)
  Top 0.203: v39.68,1.24 38.66,2.25 38.66,3.27 37.32,4.61 U2.20 | v65.69,20.13 64.67,19.12 64.26,19.12 MDL1.16
  Bottom 0.203: v39.68,1.24 43.54,1.24 43.94,0.83 48.21,0.83 51.06,3.68 61.62,3.68 66.09,8.15 66.09,19.73 v65.69,20.13
VIN  (via drill 0.51 pad 1.02)
  Top 0.254: D1.A 25.85,4.32 26.89,5.36 26.89,6.12 27.88,7.11 C7.1 C8.1 30.27,7.17 30.37,7.27 31.13,7.27 U2.7 U2.8
  Top 0.406: v19.67,6.77 18.82,6.36 17.47,5.01 J1.1 | D1.A 26.07,2.84 v26.14,2.6
  Bottom 0.406: v19.67,6.77 19.67,6.92 20.77,8.02 22.88,8.02 23.3,7.6 23.45,7.46 23.46,7.46 26.13,4.98 26.19,4.92 26.19,2.65 v26.14,2.6
VIN_PROT
  Top 0.203: C1.1 23.73,11.06 23.73,10.97
  Top 0.406: U1.1 23,11.7 23.73,10.97 R6.2 25.31,7.67 D1.C

### Text on the board
bPlace: Rev 1.16 | Env Sensor GW | GDTech | Ant